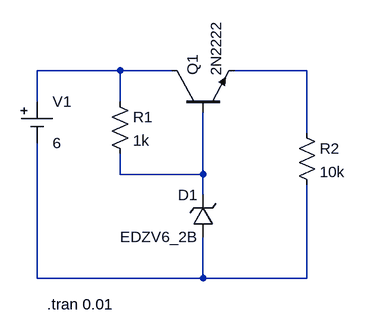
[diagram p0: schematic Regulation circuit.asc]
Regulation circuit.asc, the LTspice schematic file:
Version 4
SHEET 1 880 680
WIRE -64 144 -192 144
WIRE 16 144 -64 144
WIRE 224 144 112 144
WIRE -192 192 -192 144
WIRE -64 192 -64 144
WIRE 224 240 224 144
WIRE -64 304 -64 272
WIRE 64 304 64 208
WIRE 64 304 -64 304
WIRE 64 336 64 304
WIRE -192 464 -192 256
WIRE 64 464 64 400
WIRE 64 464 -192 464
WIRE 224 464 224 320
WIRE 224 464 64 464
SYMBOL npn 16 208 R270
SYMATTR InstName Q1
SYMATTR Value 2N2222
SYMBOL res -80 176 R0
SYMATTR InstName R1
SYMATTR Value 1k
SYMBOL Misc/cell -192 192 R0
SYMATTR InstName V1
SYMATTR Value 6
SYMBOL zener 80 400 R180
WINDOW 0 24 64 Left 2
WINDOW 3 24 0 Left 2
SYMATTR InstName D1
SYMATTR Value EDZV6_2B
SYMBOL res 208 224 R0
SYMATTR InstName R2
SYMATTR Value 10k
TEXT -176 504 Left 2 !.tran 0.01

The netlist it stands for:
* Regulation circuit.asc
Q1 N001 N003 N002 0 2N2222
R1 N001 N003 1k
V1 N001 N004 6
D1 N004 N003 EDZV6_2B
R2 N002 N004 10k
.model D D
.lib standard.dio
.model NPN NPN
.model PNP PNP
.lib standard.bjt
.tran 0.01
.backanno
.end